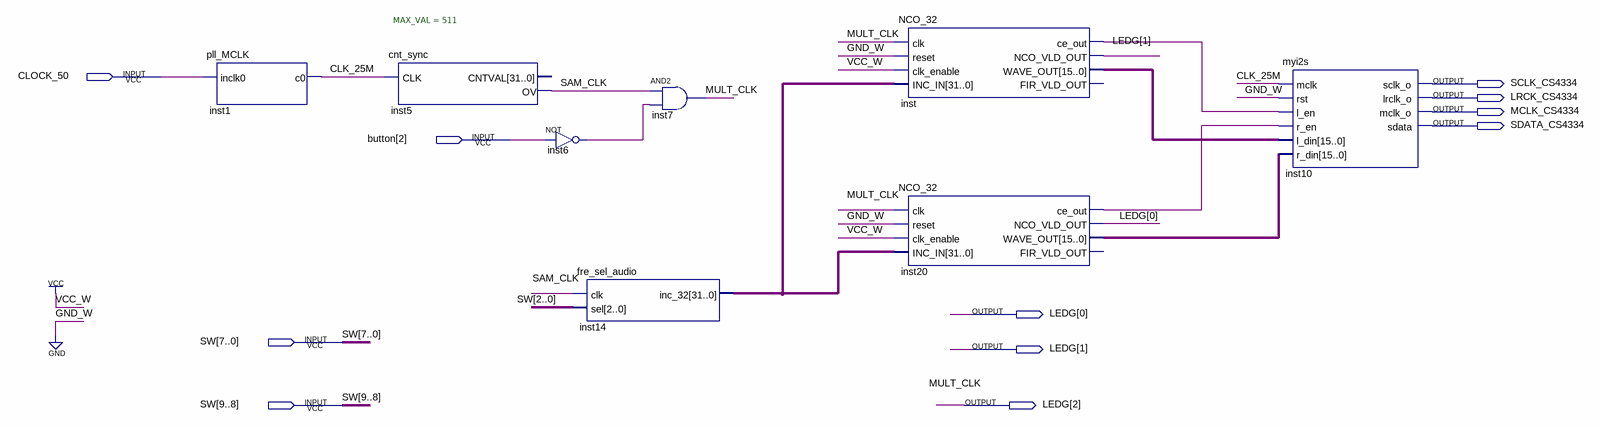
[diagram p0: schematic sheet]
// Quartus schematic NCO_quartus.bdf as structural Verilog: 8 symbols, 11 pins
module NCO_quartus (
  input  CLOCK_50,
  input  [2:2] button,
  input  [9:0] SW,
  output SCLK_CS4334,
  output LRCK_CS4334,
  output MCLK_CS4334,
  output SDATA_CS4334,
  output [2:0] LEDG
);

  wire CLK_25M, inst6_out, inst20_ce_out, inst_ce_out, SAM_CLK;
  wire [15:0] inst20_wave_out, inst_wave_out;
  wire [31:0] inst14_inc_32;

  pll_MCLK inst1 (.inclk0(CLOCK_50), .c0(CLK_25M));
  cnt_sync #(.MAX_VAL(511)) inst5 (.CLK(CLK_25M), .OV(SAM_CLK));  // open: CNTVAL
  not inst6 (inst6_out, button[2]);
  fre_sel_audio inst14 (.clk(SAM_CLK), .sel(SW[2:0]), .inc_32(inst14_inc_32));
  and inst7 (LEDG[2], SAM_CLK, inst6_out);
  NCO_32 inst (
    .clk(LEDG[2]), .reset(1'b0), .clk_enable(1'b1), .INC_IN(inst14_inc_32), .ce_out(inst_ce_out),
    .NCO_VLD_OUT(LEDG[1]), .WAVE_OUT(inst_wave_out));  // open: FIR_VLD_OUT
  NCO_32 inst20 (
    .clk(LEDG[2]), .reset(1'b0), .clk_enable(1'b1), .INC_IN(inst14_inc_32), .ce_out(inst20_ce_out),
    .NCO_VLD_OUT(LEDG[0]), .WAVE_OUT(inst20_wave_out));  // open: FIR_VLD_OUT
  myi2s inst10 (
    .mclk(CLK_25M), .rst(1'b0), .l_en(inst_ce_out), .r_en(inst20_ce_out), .l_din(inst_wave_out),
    .r_din(inst20_wave_out), .sclk_o(SCLK_CS4334), .lrclk_o(LRCK_CS4334), .mclk_o(MCLK_CS4334),
    .sdata(SDATA_CS4334));

  // Other names for the same wires on the sheet: MULT_CLK = LEDG[2]
endmodule
